# Altium schematic sheet Reed_Switch_Input.SchDoc
size A4
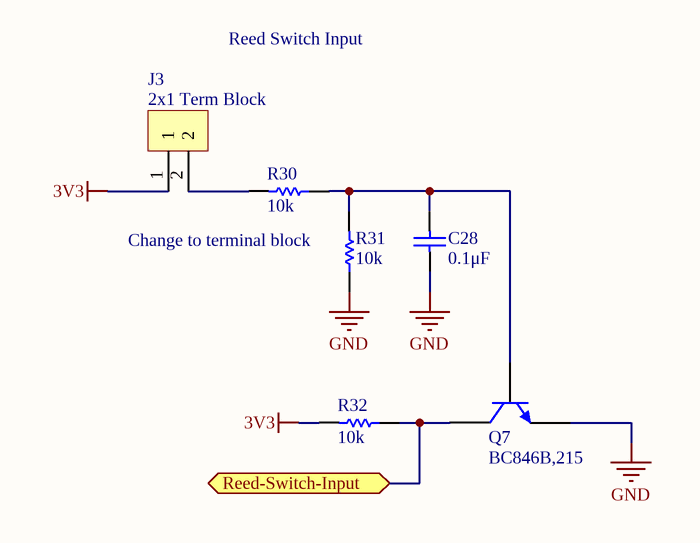
[diagram p0: Reed_Switch_Input.SchDoc]

## Parts
C28  0.1μF  [CAPC1608N(0603")]
J3  2x1 Term Block  [2X1 Terminal Blocks]
Q7  BC846B,215  [SOT-23]
R30  10k  [RESC1608N(0603")]
R31  10k  [RESC1608N(0603")]
R32  10k  [RESC1608N(0603")]

## Ports
Reed-Switch-Input

## Nets
3V3: J3.1 R32.2
GND: C28.1(Anode) Q7.2(E) R31.1
Reed-Switch-Input: Q7.3(C) R32.1 ; port Reed-Switch-Input
NetC28_2: C28.2(Cathode) Q7.1(B) R30.1 R31.2
NetJ3_2: J3.2 R30.2

## Notes on the sheet
- Reed Switch Input
- (near R31) Change to terminal block

## Library data of the parts
C28 = 0.1uF 100V 0603 SMD, Ceramic: Capacitor, Ceramic, 100V, +/- 10%, 0603 SMD, X7R; MFG: TDK; MFG#: CGA3E3X7S2A104K080AB; Published: 16-04-26; Publisher: AUVic; PackageDescription: Chip Capacitor; Value: 0.1μF; Created By: Ashwin Sira; Supplier 1: Digi-Key; Supplier Part Number 1: 445-6938-1-ND
J3 = 2x1 Terminal Block: Made by: Andy Bates; Supplier 1: Digikey; Supplier Part Number 1: ED2740-ND
Q7 = BC846B,215: NPN 65V 100mA 250mW; Published: 8-Jun-2000; LatestRevisionDate: 09-Sep-2016; DatasheetVersion: 1997; Publisher: Andy Bates; Supplier 1: Digi-Key; Supplier Part Number 1: 568-1632-1-ND
R30-R32 = 10kR, 1%, 1/10W, 0603 SMD: Made By: Ashwin Sira; Owned By: AUVic; Created On: 14-05-31; Last Edited: 14-05-31; Value: 10k; Supplier 1: Digi-Key; Supplier Part Number 1: 311-10.0KHRCT-ND